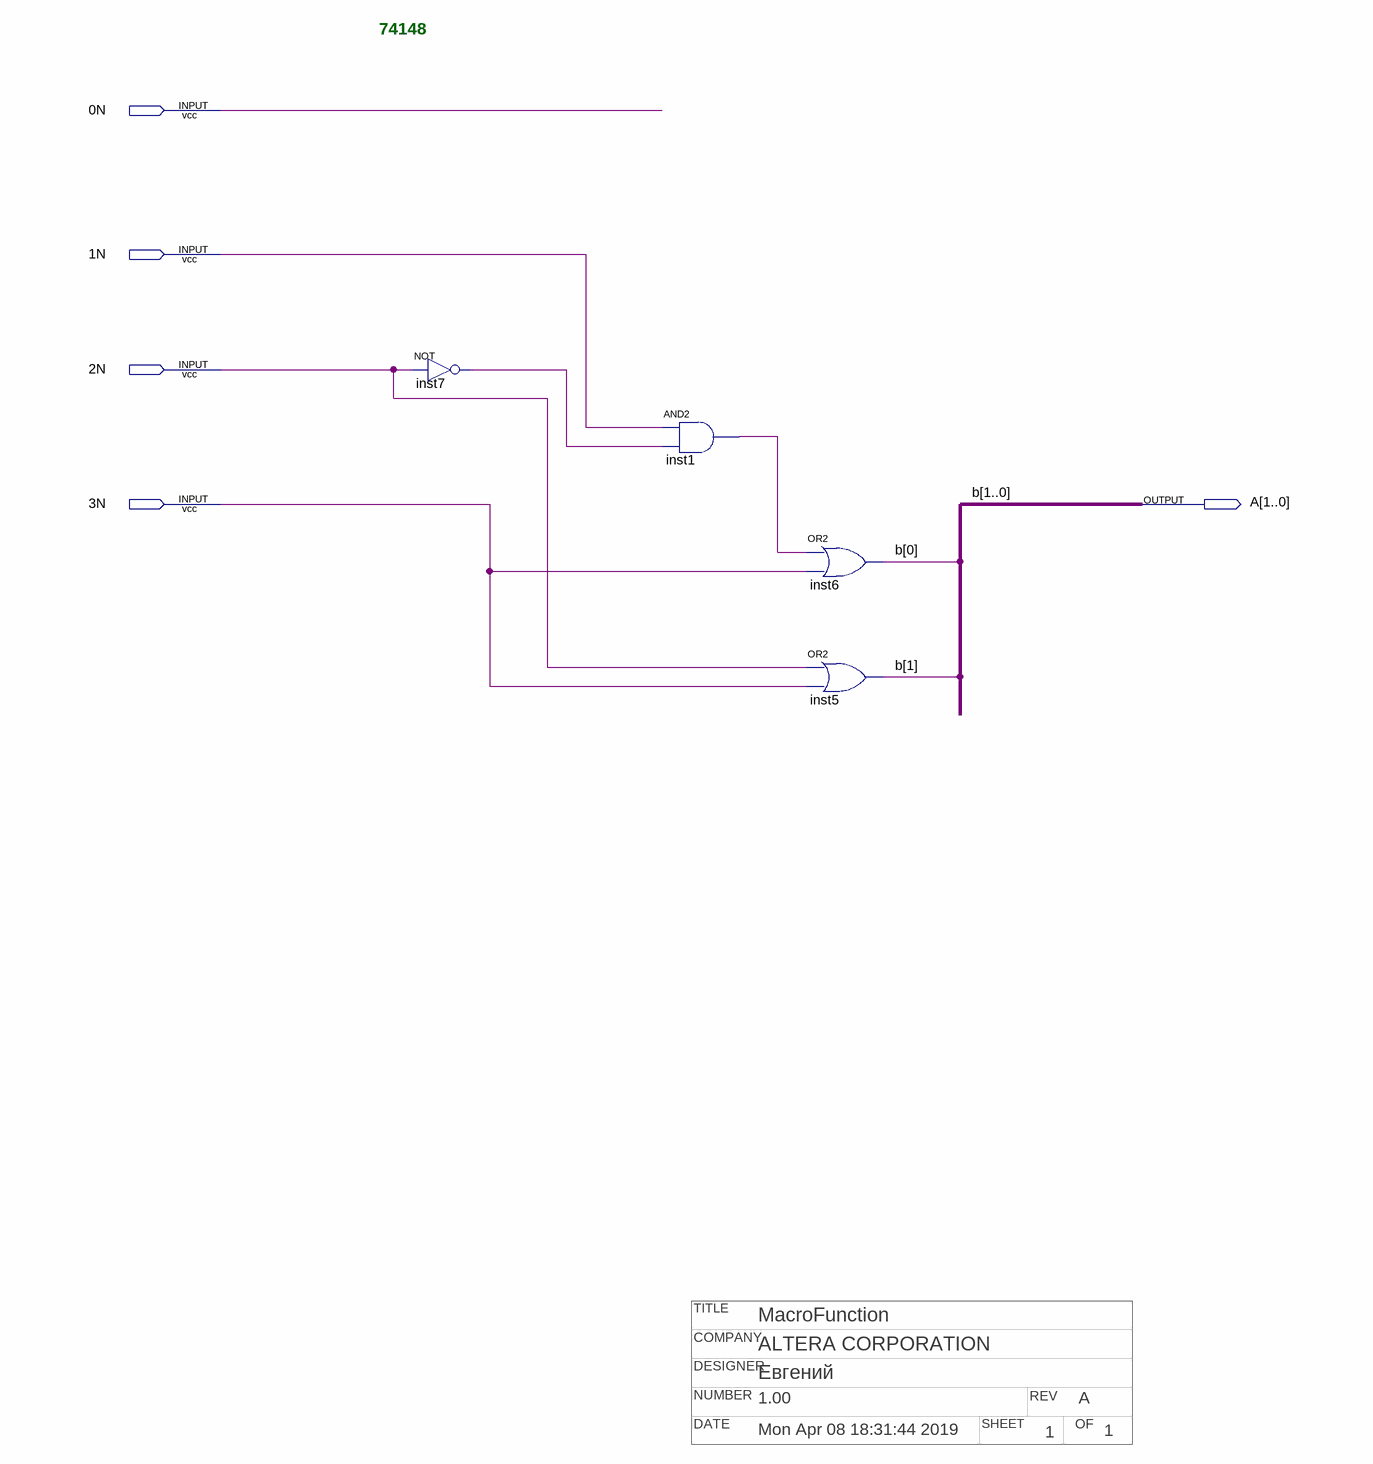
[diagram p0: schematic sheet]
// Quartus schematic CODER.bdf as structural Verilog: 4 symbols, 5 pins
// Title block: TITLE: MacroFunction; COMPANY: ALTERA CORPORATION; DESIGNER: Евгений; NUMBER: 1.00; REV: A; DATE: Mon Apr 08 18:31:44 2019; SHEET: 1; OF: 1
module CODER (
  input  \0N ,
  input  \1N ,
  input  \2N ,
  input  \3N ,
  output [1:0] A
);

  wire inst1_out, inst7_out;

  not inst7 (inst7_out, \2N );
  and inst1 (inst1_out, \1N , inst7_out);
  or inst6 (A[0], inst1_out, \3N );
  or inst5 (A[1], \2N , \3N );

  // Other names for the same wires on the sheet: b[1:0] = A

  // Notes on the sheet:
  //   74148
endmodule
